# Altium schematic sheet battery_protection.SchDoc
size A4; Projectnumber: OWN-000; Size: A4
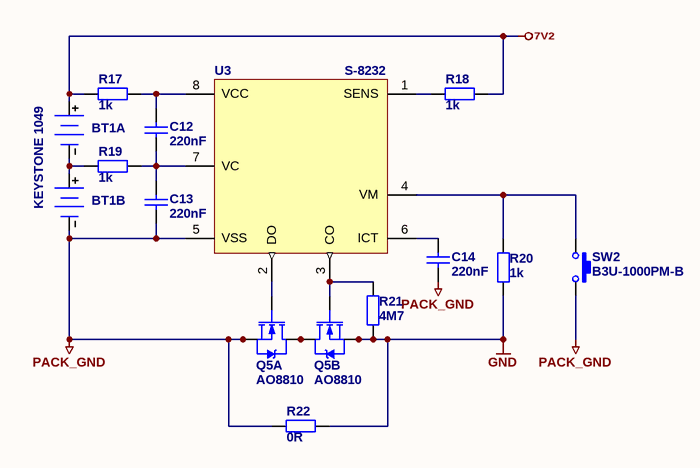
[diagram p0: battery_protection.SchDoc]

## Parts
BT1  KEYSTONE 1049  [KEYSTONE_1049]  (parts A,B of 2)  (no BOM)
C12  220nF  [C0805]
C13  220nF  [C0805]
C14  220nF  [C0805]
Q5  AO8810  [TSSOP8]  (parts A,B of 2)
R17  1k  [R0805]
R18  1k  [R0805]
R19  1k  [R0805]
R20  1k  [R0805]
R21  4M7  [R0805]
R22  0R  [R0805]
SW2  B3U-1000PM-B  [B3U-1000PM-B]
U3  S-8232  [TSSOP8]

## Nets
7V2: BT1.1(+) R17.1 R18.2
GND: Q5.6(S2) Q5.7(S2) R20.2 R21.2 R22.1
PACK_GND: BT1.3(-) C13.1 C14.1 Q5.2(S1) Q5.3(S1) R22.2 SW2.2 U3.5(VSS)
NetBT1_2: BT1.2(-) BT1.4(+) R19.1
NetC12_1: C12.1 C13.2 R19.2 U3.7(VC)
NetC12_2: C12.2 R17.2 U3.8(VCC)
NetC14_2: C14.2 U3.6(ICT)
NetQ5_1: Q5.1(D1/D2) Q5.8(D1/D3)
NetQ5_4: Q5.4(G1) U3.2(DO)
NetQ5_5: Q5.5(G2) R21.1 U3.3(CO)
NetR18_1: R18.1 U3.1(SENS)
NetR20_1: R20.1 SW2.1 U3.4(VM)

## Notes on the sheet
- PROJECT NAME:
- PROJECT NO.:
- DATE:
- TITLE:
- SHEET
- of
- DRAWN BY:
- REVISION:
- FILENAME:
- A4

## Library data of the parts
BT1 = Keystone 1049: 2x 18650 LiPo Acu in the KEYSTONE 1049 Holder; Published: 14-Sep-2006
C12-C14 = Cap: Capacitor; ComponentLink1Description: datasheet; ComponentLink2Description: supplier; Value: 220nF
Q5 = AO8810: Dual Common Drain N-Channel MOSFET: Vds=20V, Rdson<20mR@4,5V, Id=7A; Published: 20-Mar-2006; Package Reference: TSOP6 (SOT23-6); Supplier 1: TME; Supplier Part Number 1: AO8810
R17-R22 = Res: Resistor; Published: 19-Feb-2006; ComponentLink1Description: datasheet; ComponentLink2Description: supplier
  R17-R20: Value: 1k
  R21: Value: 4M7
  R22: Value: 0R
SW2 = B3U-1000PM-B: OMRON Ultra-small Tactile Switch - 12V/50mA
U3 = S-8232: Battery Protection IC For 2-Serial-Cell Pack